# Altium project centralised_bms.PrjPcb
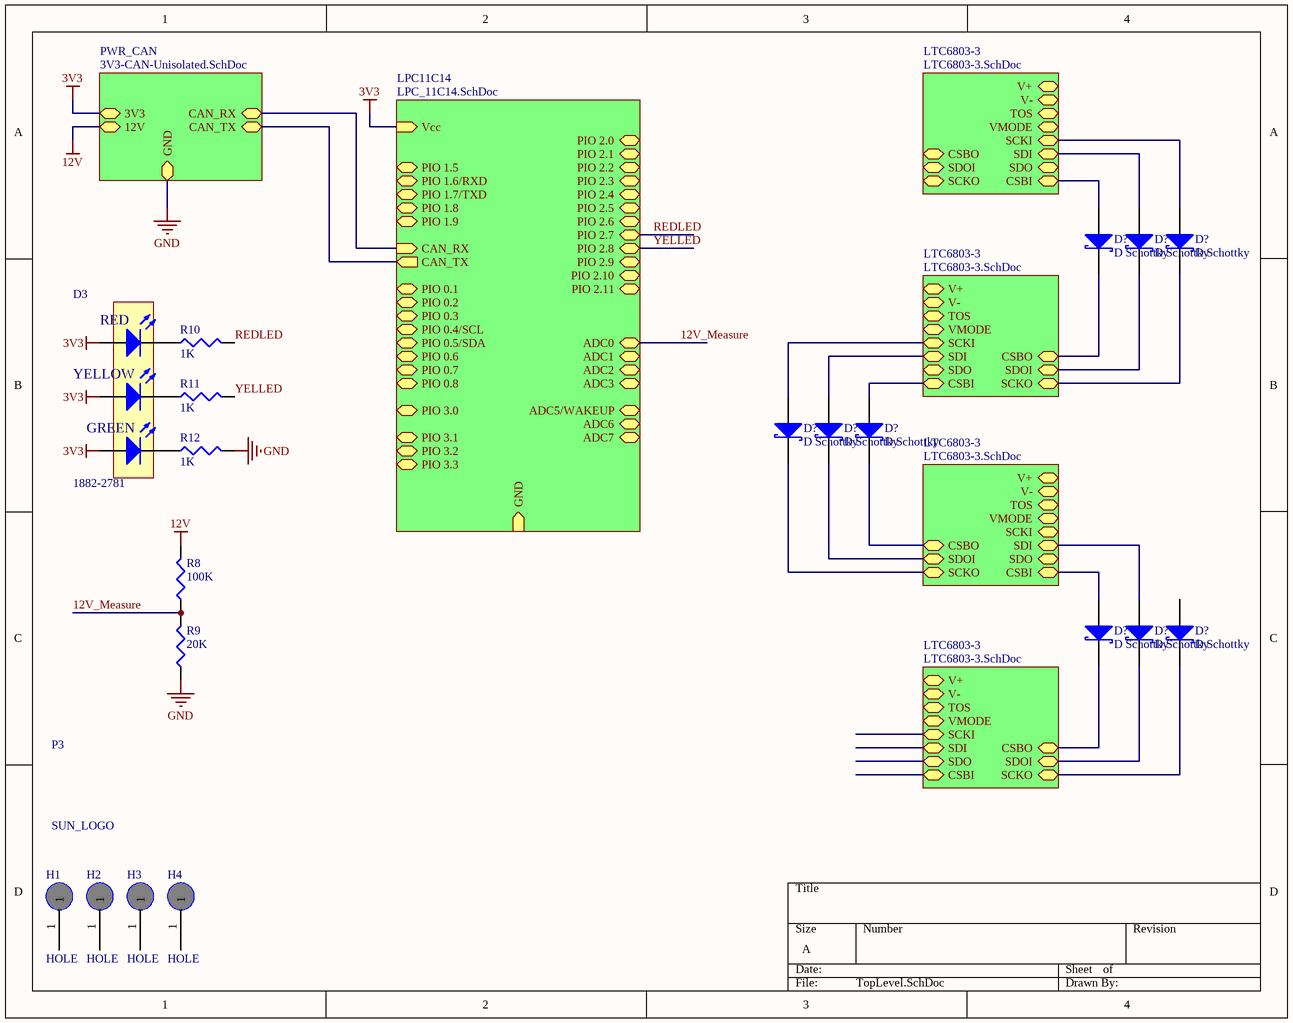
[diagram p0: TopLevel.SchDoc]
2 sheets, 64 parts. Net scope: hierarchical (ports join the sheet entries above them; power ports are global).
Sheets:
  TopLevel.SchDoc
    LTC6803-3 = LTC6803-3.SchDoc
    LTC6803-3 = LTC6803-3.SchDoc
    LTC6803-3 = LTC6803-3.SchDoc
    LTC6803-3 = LTC6803-3.SchDoc

## Sheet TopLevel.SchDoc
size A

### Parts
(Parts that share a designator on the sheet are numbered #1, #2 ... from top to bottom, then left to right.)
D3  1882-2781  [LED_TRILEVEL]
D?#1  D Schottky  [SMB]
D?#2  D Schottky  [SMB]
D?#3  D Schottky  [SMB]
D?#4  D Schottky  [SMB]
D?#5  D Schottky  [SMB]
D?#6  D Schottky  [SMB]
D?#7  D Schottky  [SMB]
D?#8  D Schottky  [SMB]
D?#9  D Schottky  [SMB]
H1  HOLE  [M2.5]
H2  HOLE  [M2.5]
H3  HOLE  [M2.5]
H4  HOLE  [M2.5]
P3  SUN_LOGO  [SUNSWIFTLOGO]
R8  100K  [0603]
R9  20K  [0603]
R10  1K  [0603]
R11  1K  [0603]
R12  1K  [0603]

### Sub-sheets
LPC11C14 = LPC_11C14.SchDoc (file not in this document): ADC5/WAKEUP (bidir), ADC6 (bidir), CAN_TX (out), CAN_RX (in), ADC7, Vcc (in), GND (in), ADC3 (bidir), ADC2 (bidir), ADC1 (bidir), ADC0 (bidir), PIO 0.4/SCL (bidir), PIO 0.5/SDA (bidir), PIO 0.7 (bidir), PIO 0.6 (bidir), PIO 0.1 (bidir), PIO 0.2, PIO 0.3, PIO 0.8, PIO 1.6/RXD (bidir), PIO 1.7/TXD (bidir), PIO 1.5, PIO 1.8, PIO 1.9, PIO 3.0 (bidir), PIO 3.1 (bidir), PIO 3.2, PIO 3.3, PIO 2.9 (bidir), PIO 2.8 (bidir), PIO 2.7 (bidir), PIO 2.11 (bidir), PIO 2.10 (bidir), PIO 2.3 (bidir), PIO 2.2 (bidir), PIO 2.1 (bidir), PIO 2.6, PIO 2.0, PIO 2.4, PIO 2.5
LTC6803-3 = LTC6803-3.SchDoc: CSBI, SDO, SDI, SCKI, VMODE, TOS, V-, V+, SCKO, SDOI, CSBO
LTC6803-3 = LTC6803-3.SchDoc: CSBI, SDO, SDI, SCKI, VMODE, TOS, V-, V+, SCKO, SDOI, CSBO
LTC6803-3 = LTC6803-3.SchDoc: CSBI, SDO, SDI, SCKI, VMODE, TOS, V-, V+, SCKO, SDOI, CSBO
LTC6803-3 = LTC6803-3.SchDoc: CSBI, SDO, SDI, SCKI, VMODE, TOS, V-, V+, SCKO, SDOI, CSBO
PWR_CAN = 3V3-CAN-Unisolated.SchDoc (file not in this document): CAN_RX (bidir), CAN_TX (bidir), 3V3 (bidir), 12V (bidir), GND (bidir)

### Nets
3V3: D3.4(A) D3.5(A) D3.6(A) ; sheet PWR_CAN/3V3, sheet LPC11C14/Vcc
12V: R8.2 ; sheet PWR_CAN/12V
GND: R9.1 R12.2 ; sheet PWR_CAN/GND
12V_Measure: R8.1 R9.2 ; sheet LPC11C14/ADC0
REDLED: R10.2 ; sheet LPC11C14/PIO 2.7
YELLED: R11.2 ; sheet LPC11C14/PIO 2.8
NetD3_1: D3.1(K) R12.1
NetD3_2: D3.2(K) R11.1
NetD3_3: D3.3(K) R10.1
NetD?#1_1: D?#1.1(A) ; sheet LTC6803-3/CSBI
NetD?#1_2: D?#1.2(K) ; sheet LTC6803-3/CSBO
NetD?#2_1: D?#2.1(A) ; sheet LTC6803-3/SDI
NetD?#2_2: D?#2.2(K) ; sheet LTC6803-3/SDOI
NetD?#3_1: D?#3.1(A) ; sheet LTC6803-3/SCKI
NetD?#3_2: D?#3.2(K) ; sheet LTC6803-3/SCKO
NetD?#4_1: D?#4.1(A) ; sheet LTC6803-3/SCKI
NetD?#4_2: D?#4.2(K) ; sheet LTC6803-3/SCKO
NetD?#5_1: D?#5.1(A) ; sheet LTC6803-3/SDI
NetD?#5_2: D?#5.2(K) ; sheet LTC6803-3/SDOI
NetD?#6_1: D?#6.1(A) ; sheet LTC6803-3/CSBI
NetD?#6_2: D?#6.2(K) ; sheet LTC6803-3/CSBO
NetD?#7_1: D?#7.1(A) ; sheet LTC6803-3/CSBI
NetD?#7_2: D?#7.2(K) ; sheet LTC6803-3/CSBO
NetD?#8_1: D?#8.1(A) ; sheet LTC6803-3/SDI
NetD?#8_2: D?#8.2(K) ; sheet LTC6803-3/SDOI
NetD?#9_2: D?#9.2(K) ; sheet LTC6803-3/SCKO
(unnamed): sheet PWR_CAN/CAN_RX, sheet LPC11C14/CAN_RX
(unnamed): sheet PWR_CAN/CAN_TX, sheet LPC11C14/CAN_TX

Not connected (* = marked no-connect by the designer): D?#9 1(A); H1 1; H2 1; H3 1; H4 1

### Library data of the parts
D3 = LED-TRILEVEL: Three level LED; Needed?: Farnell - Low Stock; Farnell: 1461596; Farnell Price: 4.56
D?#1-D?#9 = D Schottky: Schottky Diode; Published: 8-Jun-2000; LatestRevisionDate: 17-Jul-2002; LatestRevisionNote: Re-released for DXP Platform.; PackageReference: SMB; Publisher: Altium Limited; PackageDescription: DO-214-AA/SMB; 2 C-Bend Leads; Body 5.3 x 3.6 mm, inc. leads (LxW); Code_JEDEC: DO-214-AA
H1-H4 = HOLE: Needed?: NO - Footprint
R8-R12 = RES1: Resistor; Needed?: NO - HW LAB
  R8: Value: 100k
  R9: Value: 20k
  R10-R12: Value: 1k

## Sheet LTC6803-3.SchDoc
size A4
Used 4 times, as channels LTC6803-3, LTC6803-3, LTC6803-3, LTC6803-3. Parts and nets are listed once, with the designators drawn on the sheet.
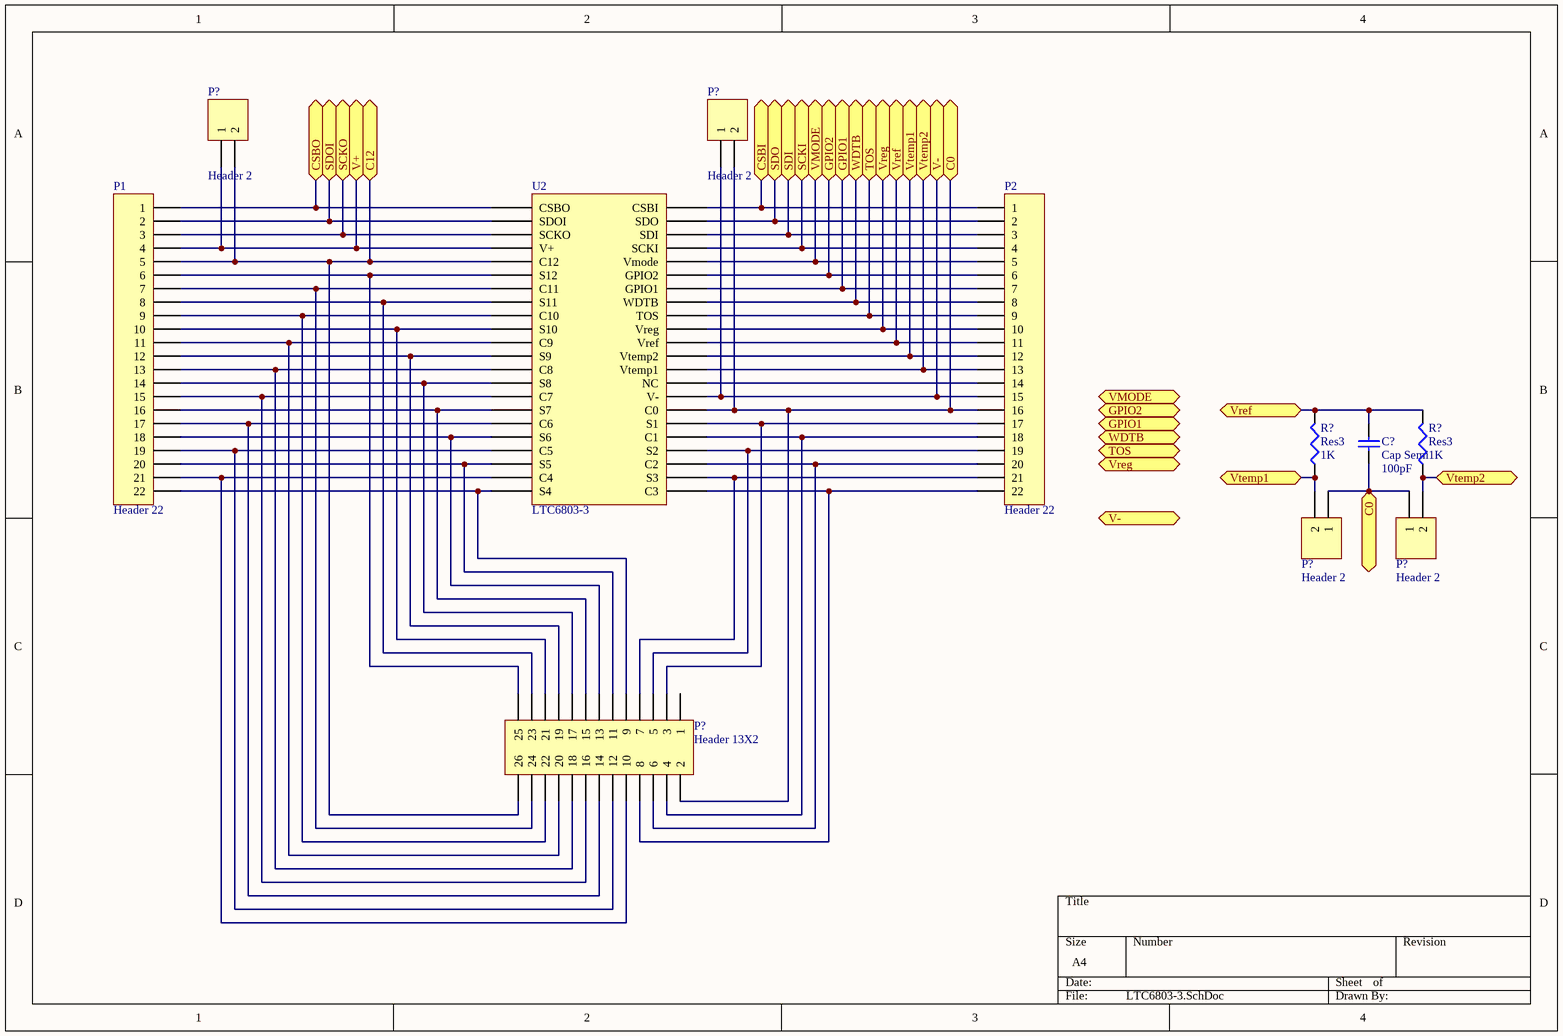
[diagram p1: LTC6803-3.SchDoc]

### Parts
(Parts that share a designator on the sheet are numbered #1, #2 ... from top to bottom, then left to right.)
C?  Cap Semi  value 100pF  [C1206]
P1  Header 22  [HDR1X22]
P2  Header 22  [HDR1X22]
P?#1  Header 2  [HDR1X2]
P?#2  Header 2  [HDR1X2]
P?#3  Header 2  [HDR1X2]
P?#4  Header 2  [HDR1X2]
P?#5  Header 13X2  [HDR2X13]
R?#1  Res3  value 1K  [J1-0603]
R?#2  Res3  value 1K  [J1-0603]
U2  LTC6803-3  [SOP44]

### Ports
C0, C12, CSBI, CSBO, GPIO1, GPIO2, SCKI, SCKO, SDI, SDO, SDOI, TOS, V+, V-, VMODE, Vref, Vreg, Vtemp1, Vtemp2, WDTB

### Nets
C0: C?.1 P2.16 P?#2.2 P?#3.1 P?#4.1 P?#5.2 U2.29(C0) ; port C0
C12: P1.5 P?#1.2 P?#5.26 U2.5(C12) ; port C12
CSBI: P2.1 U2.44(CSBI) ; port CSBI
CSBO: P1.1 U2.1(CSBO) ; port CSBO
GPIO1: P2.7 U2.38(GPIO1) ; port GPIO1
GPIO2: P2.6 U2.39(GPIO2) ; port GPIO2
SCKI: P2.4 U2.41(SCKI) ; port SCKI
SCKO: P1.3 U2.3(SCKO) ; port SCKO
SDI: P2.3 U2.42(SDI) ; port SDI
SDO: P2.2 U2.43(SDO) ; port SDO
SDOI: P1.2 U2.2(SDOI) ; port SDOI
TOS: P2.9 U2.36(TOS) ; port TOS
V+: P1.4 P?#1.1 U2.4(V+) ; port V+
V-: P2.15 P?#2.1 U2.30(V-) ; port V-
VMODE: P2.5 U2.40(Vmode) ; port VMODE
Vref: C?.2 P2.11 R?#1.2 R?#2.2 U2.34(Vref) ; port Vref
Vreg: P2.10 U2.35(Vreg) ; port Vreg
Vtemp1: P2.12 P?#3.2 R?#1.1 U2.33(Vtemp2) ; port Vtemp1
Vtemp2: P2.13 P?#4.2 R?#2.1 U2.32(Vtemp1) ; port Vtemp2
WDTB: P2.8 U2.37(WDTB) ; port WDTB
NetP1_6: P1.6 P?#5.25 U2.6(S12)
NetP1_7: P1.7 P?#5.24 U2.7(C11)
NetP1_8: P1.8 P?#5.23 U2.8(S11)
NetP1_9: P1.9 P?#5.22 U2.9(C10)
NetP1_10: P1.10 P?#5.21 U2.10(S10)
NetP1_11: P1.11 P?#5.20 U2.11(C9)
NetP1_12: P1.12 P?#5.19 U2.12(S9)
NetP1_13: P1.13 P?#5.18 U2.13(C8)
NetP1_14: P1.14 P?#5.17 U2.14(S8)
NetP1_15: P1.15 P?#5.16 U2.15(C7)
NetP1_16: P1.16 P?#5.15 U2.16(S7)
NetP1_17: P1.17 P?#5.14 U2.17(C6)
NetP1_18: P1.18 P?#5.13 U2.18(S6)
NetP1_19: P1.19 P?#5.12 U2.19(C5)
NetP1_20: P1.20 P?#5.11 U2.20(S5)
NetP1_21: P1.21 P?#5.10 U2.21(C4)
NetP1_22: P1.22 P?#5.9 U2.22(S4)
NetP2_14: P2.14 U2.31(NC)
NetP2_17: P2.17 P?#5.3 U2.28(S1)
NetP2_18: P2.18 P?#5.4 U2.27(C1)
NetP2_19: P2.19 P?#5.5 U2.26(S2)
NetP2_20: P2.20 P?#5.6 U2.25(C2)
NetP2_21: P2.21 P?#5.7 U2.24(S3)
NetP2_22: P2.22 P?#5.8 U2.23(C3)

Not connected (* = marked no-connect by the designer): P?#5 1

### Channels
LTC6803-3: designators C?=C?_LTC6803-3#1 P1=P1_LTC6803-3#1 P2=P2_LTC6803-3#1 P?=P?_LTC6803-3#5 P?=P?_LTC6803-3#1 P?=P?_LTC6803-3#2 P?=P?_LTC6803-3#4 P?=P?_LTC6803-3#3 R?=R?_LTC6803-3#2 R?=R?_LTC6803-3#1 U2=U2_LTC6803-3#1; ports C0=NetC?_LTC6803-3#1_1 C12=NetP1_LTC6803-3#1_5 CSBI=NetD?#7_1 CSBO=NetD?#6_2 GPIO1=NetP2_LTC6803-3#1_7 GPIO2=NetP2_LTC6803-3#1_6 SCKI=NetP2_LTC6803-3#1_4 SCKO=NetD?#4_2 SDI=NetD?#8_1 SDO=NetP2_LTC6803-3#1_2 SDOI=NetD?#5_2 TOS=NetP2_LTC6803-3#1_9 V+=NetP1_LTC6803-3#1_4 V-=NetP2_LTC6803-3#1_15 VMODE=NetP2_LTC6803-3#1_5 Vref=NetC?_LTC6803-3#1_2 Vreg=NetP2_LTC6803-3#1_10 Vtemp1=NetP2_LTC6803-3#1_12 Vtemp2=NetP2_LTC6803-3#1_13 WDTB=NetP2_LTC6803-3#1_8
LTC6803-3: designators C?=C?_LTC6803-3#2 P1=P1_LTC6803-3#2 P2=P2_LTC6803-3#2 P?=P?_LTC6803-3#10 P?=P?_LTC6803-3#6 P?=P?_LTC6803-3#7 P?=P?_LTC6803-3#9 P?=P?_LTC6803-3#8 R?=R?_LTC6803-3#4 R?=R?_LTC6803-3#3 U2=U2_LTC6803-3#2; ports C0=NetC?_LTC6803-3#2_1 C12=NetP1_LTC6803-3#2_5 CSBI=NetP2_LTC6803-3#2_1 CSBO=NetD?#7_2 GPIO1=NetP2_LTC6803-3#2_7 GPIO2=NetP2_LTC6803-3#2_6 SCKI=NetP2_LTC6803-3#2_4 SCKO=NetD?#9_2 SDI=NetP2_LTC6803-3#2_3 SDO=NetP2_LTC6803-3#2_2 SDOI=NetD?#8_2 TOS=NetP2_LTC6803-3#2_9 V+=NetP1_LTC6803-3#2_4 V-=NetP2_LTC6803-3#2_15 VMODE=NetP2_LTC6803-3#2_5 Vref=NetC?_LTC6803-3#2_2 Vreg=NetP2_LTC6803-3#2_10 Vtemp1=NetP2_LTC6803-3#2_12 Vtemp2=NetP2_LTC6803-3#2_13 WDTB=NetP2_LTC6803-3#2_8
LTC6803-3: designators C?=C?_LTC6803-3#3 P1=P1_LTC6803-3#3 P2=P2_LTC6803-3#3 P?=P?_LTC6803-3#15 P?=P?_LTC6803-3#11 P?=P?_LTC6803-3#12 P?=P?_LTC6803-3#14 P?=P?_LTC6803-3#13 R?=R?_LTC6803-3#6 R?=R?_LTC6803-3#5 U2=U2_LTC6803-3#3; ports C0=NetC?_LTC6803-3#3_1 C12=NetP1_LTC6803-3#3_5 CSBI=NetD?#6_1 CSBO=NetD?#1_2 GPIO1=NetP2_LTC6803-3#3_7 GPIO2=NetP2_LTC6803-3#3_6 SCKI=NetD?#4_1 SCKO=NetD?#3_2 SDI=NetD?#5_1 SDO=NetP2_LTC6803-3#3_2 SDOI=NetD?#2_2 TOS=NetP2_LTC6803-3#3_9 V+=NetP1_LTC6803-3#3_4 V-=NetP2_LTC6803-3#3_15 VMODE=NetP2_LTC6803-3#3_5 Vref=NetC?_LTC6803-3#3_2 Vreg=NetP2_LTC6803-3#3_10 Vtemp1=NetP2_LTC6803-3#3_12 Vtemp2=NetP2_LTC6803-3#3_13 WDTB=NetP2_LTC6803-3#3_8
LTC6803-3: designators C?=C?_LTC6803-3#4 P1=P1_LTC6803-3#4 P2=P2_LTC6803-3#4 P?=P?_LTC6803-3#20 P?=P?_LTC6803-3#16 P?=P?_LTC6803-3#17 P?=P?_LTC6803-3#19 P?=P?_LTC6803-3#18 R?=R?_LTC6803-3#8 R?=R?_LTC6803-3#7 U2=U2_LTC6803-3#4; ports C0=NetC?_LTC6803-3#4_1 C12=NetP1_LTC6803-3#4_5 CSBI=NetD?#1_1 CSBO=NetP1_LTC6803-3#4_1 GPIO1=NetP2_LTC6803-3#4_7 GPIO2=NetP2_LTC6803-3#4_6 SCKI=NetD?#3_1 SCKO=NetP1_LTC6803-3#4_3 SDI=NetD?#2_1 SDO=NetP2_LTC6803-3#4_2 SDOI=NetP1_LTC6803-3#4_2 TOS=NetP2_LTC6803-3#4_9 V+=NetP1_LTC6803-3#4_4 V-=NetP2_LTC6803-3#4_15 VMODE=NetP2_LTC6803-3#4_5 Vref=NetC?_LTC6803-3#4_2 Vreg=NetP2_LTC6803-3#4_10 Vtemp1=NetP2_LTC6803-3#4_12 Vtemp2=NetP2_LTC6803-3#4_13 WDTB=NetP2_LTC6803-3#4_8

### Library data of the parts
C? = Cap Semi: Capacitor (Semiconductor SIM Model); Published: 8-Jun-2000; LatestRevisionDate: 29-May-2009; LatestRevisionNote: IPC-7351 Footprint Added.; PackageReference: C1206; Publisher: Altium Limited; PackageDescription: Chip Capacitor
P1 P2 = Header 22: Header, 22-Pin; LatestRevisionDate: 17-Jul-2002; LatestRevisionNote: Re-released for DXP Platform.; Publisher: Altium Limited
P?#1-P?#4 = Header 2: Header, 2-Pin; LatestRevisionDate: 17-Jul-2002; LatestRevisionNote: Re-released for DXP Platform.; Publisher: Altium Limited
P?#5 = Header 13X2: Header, 13-Pin, Dual row; LatestRevisionDate: 17-Jul-2002; LatestRevisionNote: Re-released for DXP Platform.; Publisher: Altium Limited
R?#1 R?#2 = Res3: Resistor; Published: 8-Jun-2000; LatestRevisionDate: 29-May-2009; LatestRevisionNote: IPC-7351 Footprint Added.; PackageReference: J1-0603; Publisher: Altium Limited; PackageDescription: Chip Resistor

## Nets that join several sheets
NetD?#1_1: TopLevel (D?#1.1), LTC6803-3 (P2_LTC6803-3#4.1 U2_LTC6803-3#4.44)
NetD?#1_2: TopLevel (D?#1.2), LTC6803-3 (P1_LTC6803-3#3.1 U2_LTC6803-3#3.1)
NetD?#2_1: TopLevel (D?#2.1), LTC6803-3 (P2_LTC6803-3#4.3 U2_LTC6803-3#4.42)
NetD?#2_2: TopLevel (D?#2.2), LTC6803-3 (P1_LTC6803-3#3.2 U2_LTC6803-3#3.2)
NetD?#3_1: TopLevel (D?#3.1), LTC6803-3 (P2_LTC6803-3#4.4 U2_LTC6803-3#4.41)
NetD?#3_2: TopLevel (D?#3.2), LTC6803-3 (P1_LTC6803-3#3.3 U2_LTC6803-3#3.3)
NetD?#4_1: TopLevel (D?#4.1), LTC6803-3 (P2_LTC6803-3#3.4 U2_LTC6803-3#3.41)
NetD?#4_2: TopLevel (D?#4.2), LTC6803-3 (P1_LTC6803-3#1.3 U2_LTC6803-3#1.3)
NetD?#5_1: TopLevel (D?#5.1), LTC6803-3 (P2_LTC6803-3#3.3 U2_LTC6803-3#3.42)
NetD?#5_2: TopLevel (D?#5.2), LTC6803-3 (P1_LTC6803-3#1.2 U2_LTC6803-3#1.2)
NetD?#6_1: TopLevel (D?#6.1), LTC6803-3 (P2_LTC6803-3#3.1 U2_LTC6803-3#3.44)
NetD?#6_2: TopLevel (D?#6.2), LTC6803-3 (P1_LTC6803-3#1.1 U2_LTC6803-3#1.1)
NetD?#7_1: TopLevel (D?#7.1), LTC6803-3 (P2_LTC6803-3#1.1 U2_LTC6803-3#1.44)
NetD?#7_2: TopLevel (D?#7.2), LTC6803-3 (P1_LTC6803-3#2.1 U2_LTC6803-3#2.1)
NetD?#8_1: TopLevel (D?#8.1), LTC6803-3 (P2_LTC6803-3#1.3 U2_LTC6803-3#1.42)
NetD?#8_2: TopLevel (D?#8.2), LTC6803-3 (P1_LTC6803-3#2.2 U2_LTC6803-3#2.2)
NetD?#9_2: TopLevel (D?#9.2), LTC6803-3 (P1_LTC6803-3#2.3 U2_LTC6803-3#2.3)